# Altium schematic sheet Gate Driver.SchDoc
size A
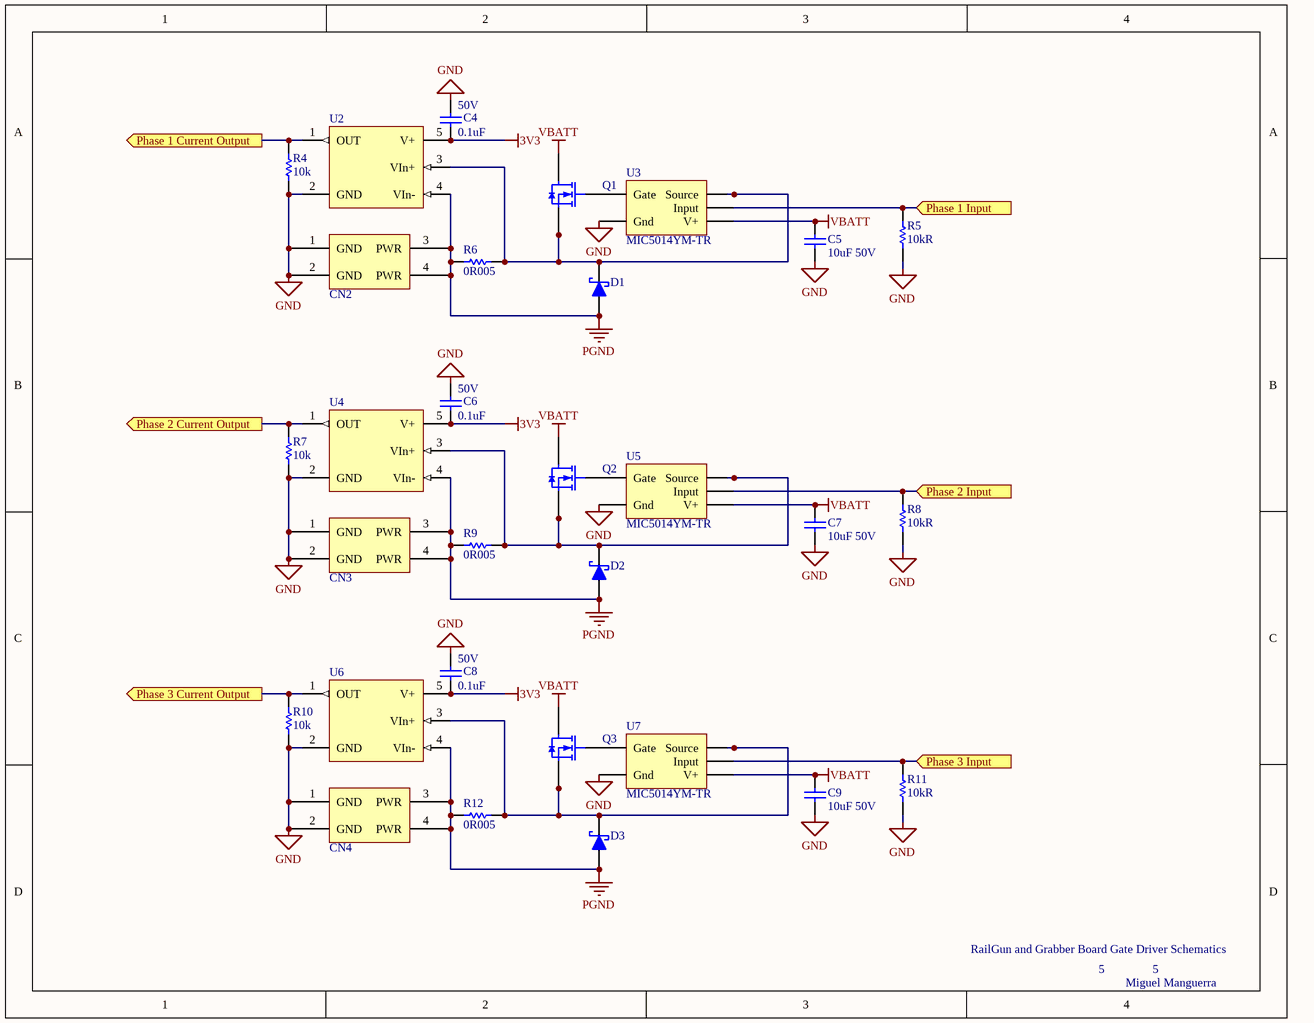
[diagram p0: Gate Driver.SchDoc]

## Parts
C4  Voltage: 50V  Capacitance: 0.1uF  [FP-CL10-0_1-MFG]  (hidden comment: CL10B104JB8NNNC)
C5  10uF 50V  [CAPC3216N(1206")]
C6  Voltage: 50V  Capacitance: 0.1uF  [FP-CL10-0_1-MFG]  (hidden comment: CL10B104JB8NNNC)
C7  10uF 50V  [CAPC3216N(1206")]
C8  Voltage: 50V  Capacitance: 0.1uF  [FP-CL10-0_1-MFG]  (hidden comment: CL10B104JB8NNNC)
C9  10uF 50V  [CAPC3216N(1206")]
CN2  Header, Female, 2x2, RIght Angle, Pitch: 0.118"  (3.00mm), THT  [2x2 Pitch 118mil connector]  (value not drawn)
CN3  Header, Female, 2x2, RIght Angle, Pitch: 0.118"  (3.00mm), THT  [2x2 Pitch 118mil connector]  (value not drawn)
CN4  Header, Female, 2x2, RIght Angle, Pitch: 0.118"  (3.00mm), THT  [2x2 Pitch 118mil connector]  (value not drawn)
D1  TSSA5U50E3GCT-ND  [DO-214AC]  (value not drawn)
D2  TSSA5U50E3GCT-ND  [DO-214AC]  (value not drawn)
D3  TSSA5U50E3GCT-ND  [DO-214AC]  (value not drawn)
Q1  MOSFET N-Channel  [LFPAK-PowerSO8]  (value not drawn)
Q2  MOSFET N-Channel  [LFPAK-PowerSO8]  (value not drawn)
Q3  MOSFET N-Channel  [LFPAK-PowerSO8]  (value not drawn)
R4  value 10k  [RESC1608N(0603")]  (hidden comment: 10kR, 1%, 1/10W, 0603 SMD)
R5  10kR  [RESC1608N(0603")]
R6  value 0R005  [RESC6332N(2512")]  (hidden comment: 0R005, 1%, 3W, 2512 SMD)
R7  value 10k  [RESC1608N(0603")]  (hidden comment: 10kR, 1%, 1/10W, 0603 SMD)
R8  10kR  [RESC1608N(0603")]
R9  value 0R005  [RESC6332N(2512")]  (hidden comment: 0R005, 1%, 3W, 2512 SMD)
R10  value 10k  [RESC1608N(0603")]  (hidden comment: 10kR, 1%, 1/10W, 0603 SMD)
R11  10kR  [RESC1608N(0603")]
R12  value 0R005  [RESC6332N(2512")]  (hidden comment: 0R005, 1%, 3W, 2512 SMD)
U2  INA168, Current Sensor, High-Side, Analog  [SOT23-5]  (value not drawn)
U3  MIC5014YM-TR  [SOC 8]
U4  INA168, Current Sensor, High-Side, Analog  [SOT23-5]  (value not drawn)
U5  MIC5014YM-TR  [SOC 8]
U6  INA168, Current Sensor, High-Side, Analog  [SOT23-5]  (value not drawn)
U7  MIC5014YM-TR  [SOC 8]

## Ports
Phase 1 Current Output (out), Phase 1 Input (in), Phase 2 Current Output (out), Phase 2 Input (in), Phase 3 Current Output (out), Phase 3 Input (in)

## Nets
3V3: C4.2 C6.2 C8.2 U2.5(V+) U4.5(V+) U6.5(V+)
GND: C4.1 C5.2(Cathode) C6.1 C7.2(Cathode) C8.1 C9.2(Cathode) CN2.1(GND) CN2.2(GND) CN3.1(GND) CN3.2(GND) CN4.1(GND) CN4.2(GND) R4.1 R5.2 R7.1 R8.2 R10.1 R11.2 U2.2(GND) U3.4(Gnd) U4.2(GND) U5.4(Gnd) U6.2(GND) U7.4(Gnd)
PGND: CN2.3(PWR) CN2.4(PWR) CN3.3(PWR) CN3.4(PWR) CN4.3(PWR) CN4.4(PWR) D1.1(Anode) D2.1(Anode) D3.1(Anode) R6.1 R9.1 R12.1 U2.4(VIn-) U4.4(VIn-) U6.4(VIn-)
VBATT: C5.1(Anode) C7.1(Anode) C9.1(Anode) Q1.5(Drain) Q2.5(Drain) Q3.5(Drain) U3.1(V+) U5.1(V+) U7.1(V+)
Phase 1 Current Output: R4.2 U2.1(OUT) ; port Phase 1 Current Output
Phase 1 Input: R5.1 U3.2(Input) ; port Phase 1 Input
Phase 2 Current Output: R7.2 U4.1(OUT) ; port Phase 2 Current Output
Phase 2 Input: R8.1 U5.2(Input) ; port Phase 2 Input
Phase 3 Current Output: R10.2 U6.1(OUT) ; port Phase 3 Current Output
Phase 3 Input: R11.1 U7.2(Input) ; port Phase 3 Input
NetD1_2: D1.2(Cathode) Q1.1(Source) Q1.2(Source) Q1.3(Source) R6.2 U2.3(VIn+) U3.3(Source)
NetD2_2: D2.2(Cathode) Q2.1(Source) Q2.2(Source) Q2.3(Source) R9.2 U4.3(VIn+) U5.3(Source)
NetD3_2: D3.2(Cathode) Q3.1(Source) Q3.2(Source) Q3.3(Source) R12.2 U6.3(VIn+) U7.3(Source)
NetQ1_4: Q1.4(Gate) U3.5(Gate)
NetQ2_4: Q2.4(Gate) U5.5(Gate)
NetQ3_4: Q3.4(Gate) U7.5(Gate)

## Notes on the sheet
- RailGun and Grabber Board Gate Driver Schematics
- 5
- Miguel Manguerra

## Library data of the parts
C4 C6 C8 = CMP-00000-3: CAP CER 0.1UF 50V X7R 0603; Tolerance: 5%; Material: Ceramic; Case Code (Imperial): 0603; Mount: Surface Mount; Thickness: 0.035inch; Depth: 0.8mm; Packaging: Tape and Reel; Package Quantity: 1; Dielectric: X7R; Height: 0.8mm; Radiation Hardening: No; Max Operating Temperature: 125°C; Voltage Rating: 50V; Case/Package: 0603; Min Operating Temperature: -55°C; Case Code (Metric): 1608; Length: 1.6mm; Contact Plating: Tin; Width: 0.031inch
C5 C7 C9 = CMP-006-0018-1: Capacitor, Ceramic, 50V, +/- 10%, 1206 SMD, X5R; Value: 10µF; Component Type: Standard; PackageDescription: Chip Capacitor; Design Item ID: 10uF 50V 1206 SMD, Ceramic; Published: 14-06-01; Publisher: AUVic; Source: AUVic_Schematic_Library_Capacitors.SchLib; Pin Count: 2
CN2-CN4 = CMP-005-0021-4: Connector Header Through Hole, Right Angle 4 position 0.118" (3.00mm); Created By: Poorna Chander Kalidas; Component Type: Standard; Source: AUVic_Schematic_Library_Connectors.SchLib; Publisher: AUVic; Design Item ID: Header, Female, 2x2, RIght Angle, Pitch: 0.118"  (3.00mm), THT; Date Published: 2020-05-16; Pin Count: 4
D1-D3 = CMP-057-0021-1: Diode Schottky 50V 5A Surface Mount DO-214AC (SMA); Source: AUVic_Schematic_Library_Diodes.SchLib; Design Item ID: TSSA5U50E3GCT-ND; Date Created: 2018-06-01; Pin Count: 2; Component Type: Standard; Created By: Poorna Chander Kalidas
Q1-Q3 = CMP-052-0019-1: MOSFET N-Channel, 40V, 100A, 272W, Enh-Mode; MFG#: PSMN1R8-40YLC,115; MFG: NXP Semiconductors; Reviewed_By: Ashwin Sira; Latest_Revision_Note: Attached footprint; Publisher: AUVic; Design Item ID: MOSFET N-Channel, 40V, 100A, 272W; Created By: Ashwin Sira; Component Type: Standard; Latest_Revision_Date: 2016_04_26; Source: AUVic_Schematic_Library_Transistors.SchLib; Latest_Revision_By: Ashwin Sira; Reviewed_Date: 2016_04_26; Pin Count: 5
R4 R7 R10 = CMP-047-0013-1: Owned By: AUVic; Made By: Ashwin Sira; Design Item ID: 10kR, 1%, 1/10W, 0603 SMD; Pin Count: 2; Component Type: Standard; Created On: 14-05-31; Last Edited: 14-05-31; Source: AUVic_Schematic_Library_Resistors.SchLib
R5 R8 R11 = CMP-047-0013-1: 10kR, 1%, 1/10W, 0603 SMD; Owned By: AUVic; Made By: Ashwin Sira; Value: 10k; Design Item ID: 10kR, 1%, 1/10W, 0603 SMD; Pin Count: 2; Component Type: Standard; Created On: 14-05-31; Last Edited: 14-05-31; Source: AUVic_Schematic_Library_Resistors.SchLib
R6 R9 R12 = CMP-047-0004-1: MFG: Riedon; Component Type: Standard; Pin Count: 2; Source: AUVic_Schematic_Library_Resistors.SchLib; Created By: Andy Bates; Created On: 10-Nov-2017; Publisher: AUVic; Design Item ID: 0R005, 1%, 3W, 2512 SMD
U2 U4 U6 = CMP-048-0001-1: Source: AUVic_Schematic_Library_Sensors.SchLib; Component Type: Standard; Pin Count: 5; Created By: Jacob Lower; Design Item ID: INA168, Current Sensor, High-Side, Analog; Created on: 2016-03-16; Publisher: AUVic
U3 U5 U7 = CMP-028-0000-2: High-Side or Low-Side Gate Driver IC Non-Inverting 8-SOIC; Number of Drivers: 1; Turn-On Delay Time: 8ms; Min Supply Voltage: 2.75V; Max Supply Voltage: 30V; Turn-Off Delay Time: 30us; Channel Type: Single; Max Output Current: 10mA; Lead Free: Lead Free; Max Operating Temperature: 85°C; Number of Pins: 8; Min Operating Temperature: -40°C; Height: 1.48mm; Mount: Surface Mount; Package Quantity: 2500; Case/Package: SOIC; Packaging: Tape and Reel; Number of Outputs: 1; Width: 3.94mm; Length: 4.93mm